# Altium project OpenRex_V1I1.PrjPcb (part 8 of 13)

## Sheet [25] - LEDS, BUTTONS.SchDoc
size A2; DocumentNumber: 25; SheetNumber: 25; SheetTotal: 31
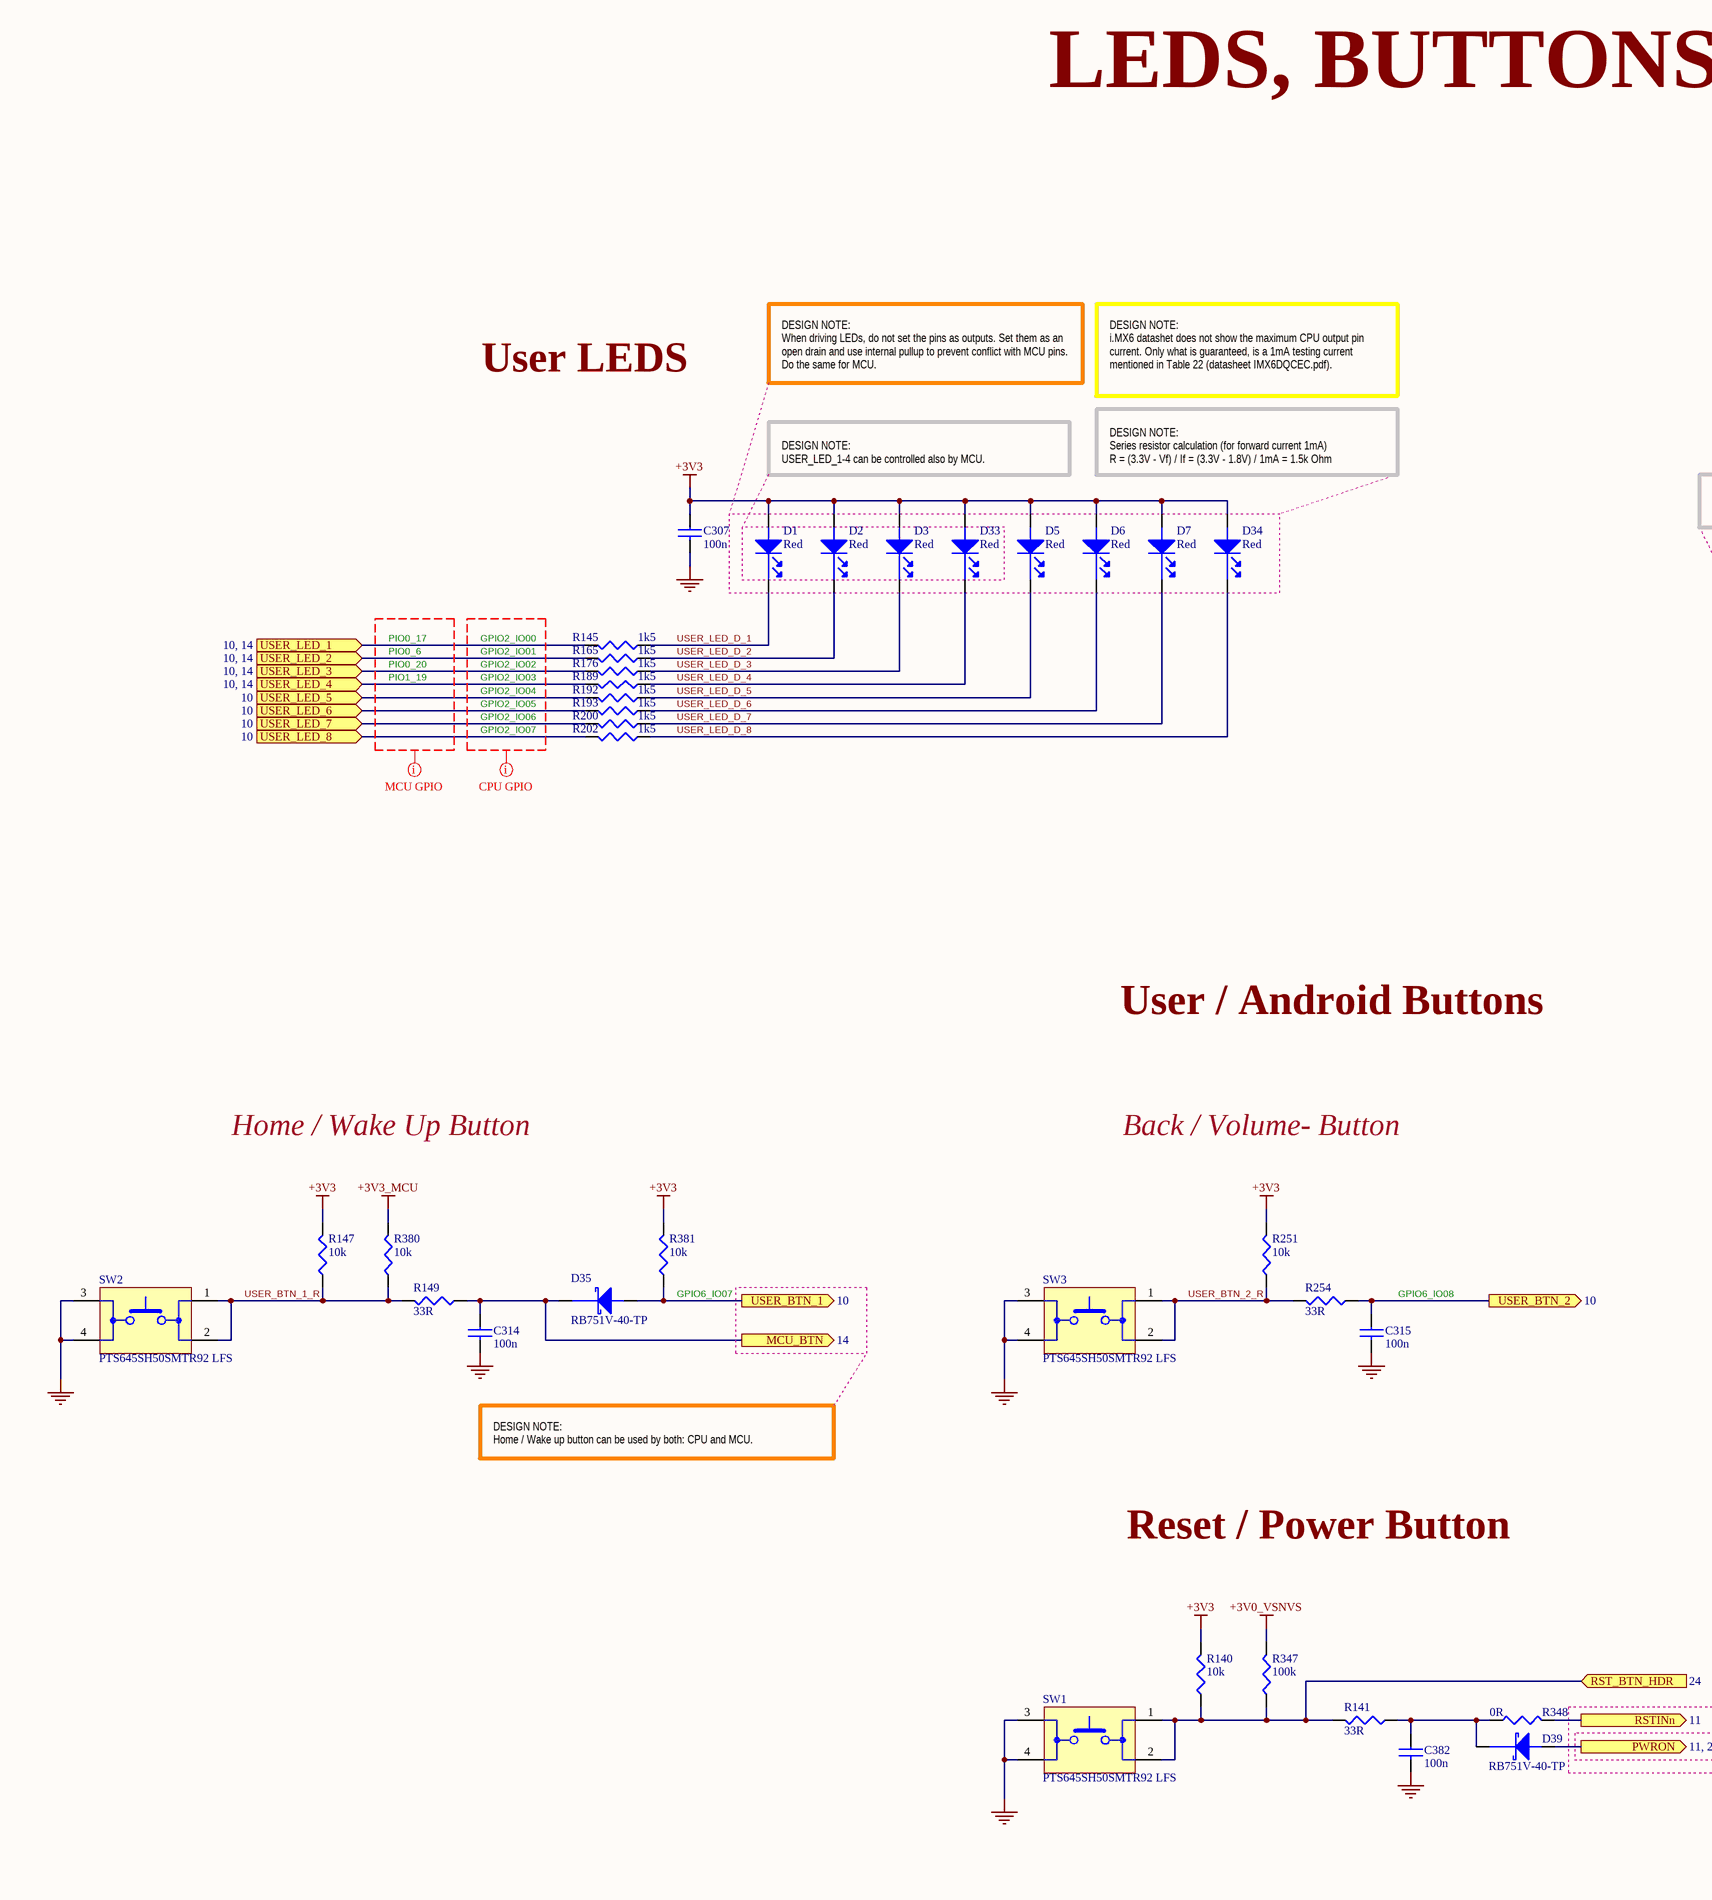
[diagram p32: [25] - LEDS, BUTTONS.SchDoc, left]
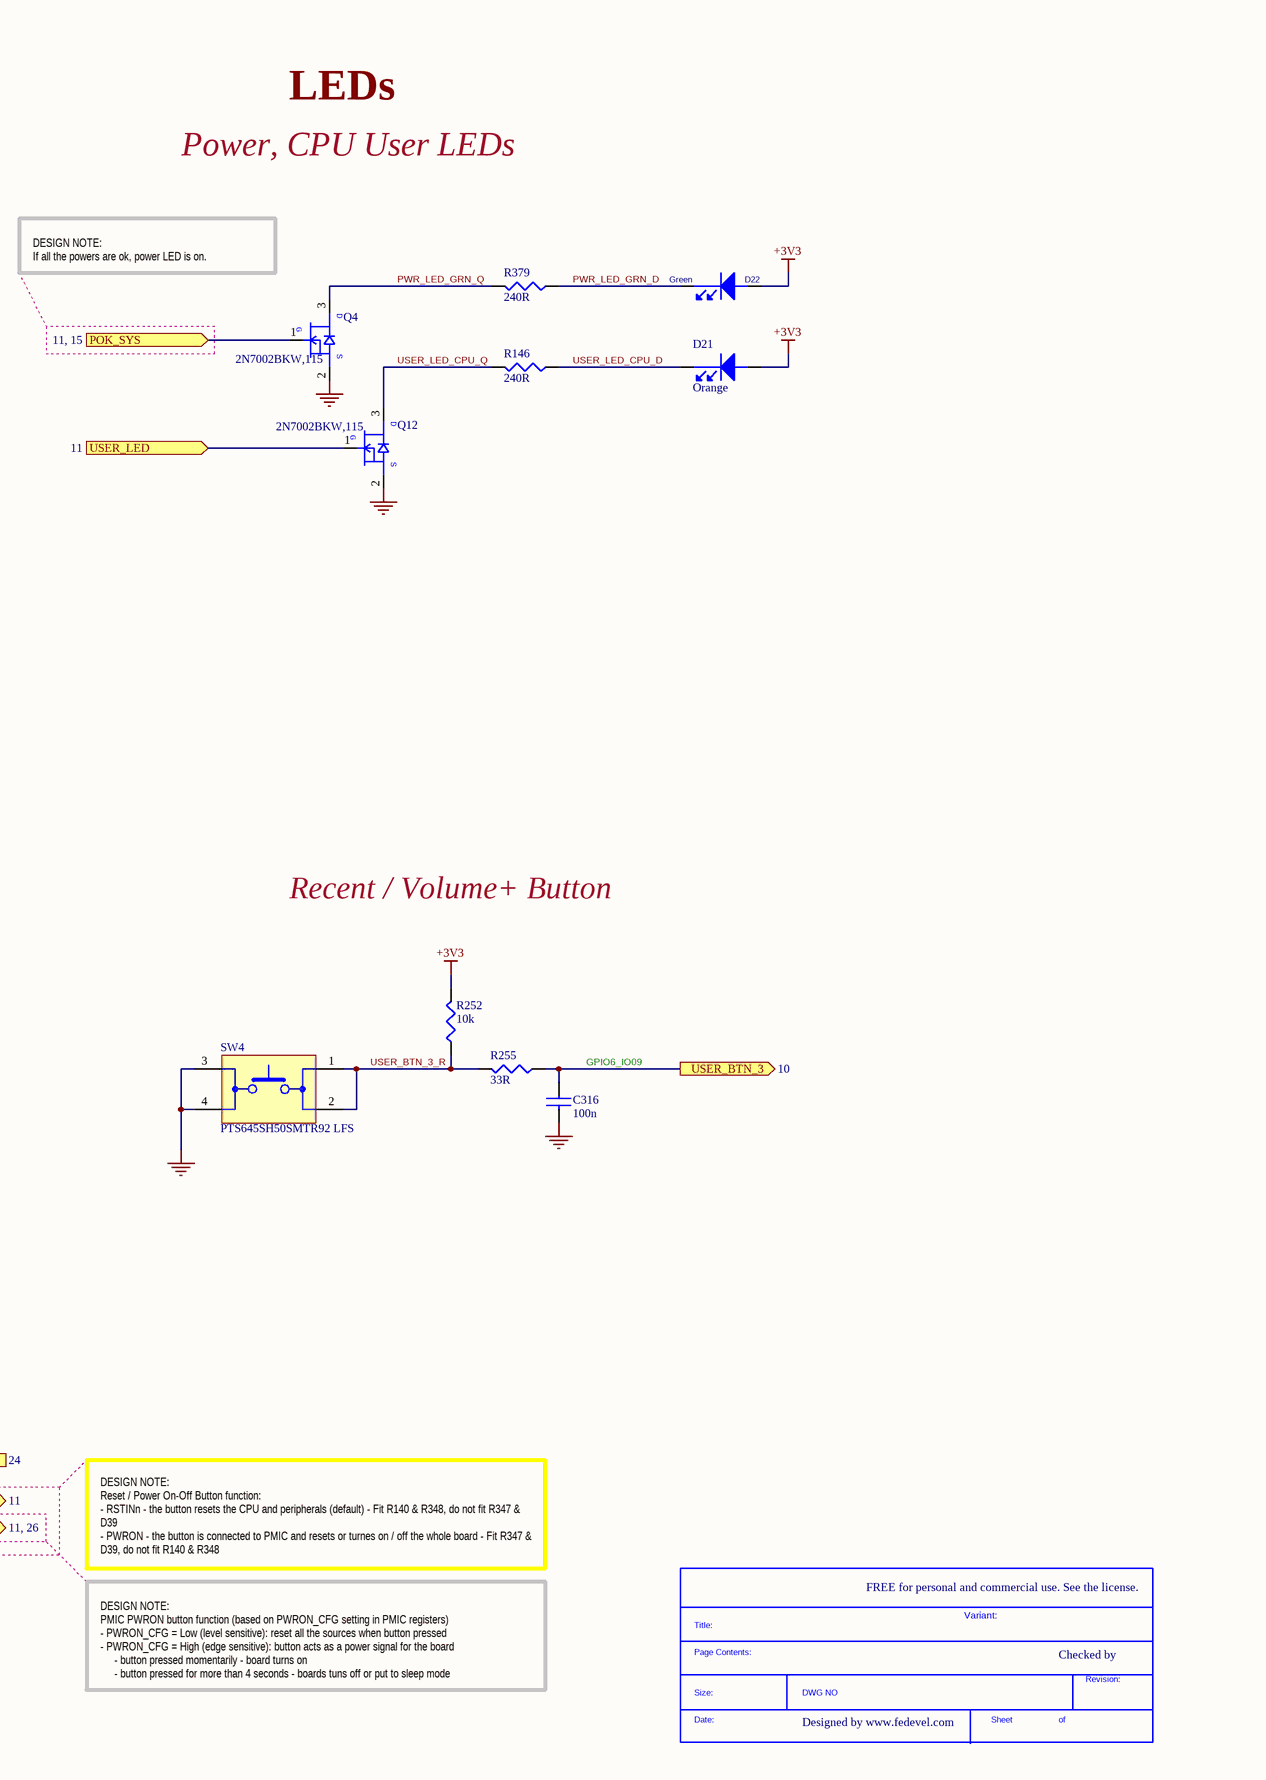
[diagram p33: [25] - LEDS, BUTTONS.SchDoc, right]

### Parts
(Parts that share a designator on the sheet are numbered #1, #2 ... from top to bottom, then left to right.)
*#20  SDTitleBlock  (value not drawn)  (graphical)
C307  100n  [C0402]
C314  100n  [C0402]
C315  100n  [C0402]
C316  100n  [C0402]
C382  100n  [C0402]
D1  Red  [LED_0603]
D2  Red  [LED_0603]
D3  Red  [LED_0603]
D5  Red  [LED_0603]
D6  Red  [LED_0603]
D7  Red  [LED_0603]
D21  Orange  [LED_0603]
D22  Green  [LED_0603]
D33  Red  [LED_0603]
D34  Red  [LED_0603]
D35  RB751V-40-TP  [SOD323]
D39  RB751V-40-TP  [SOD323]
Q4  2N7002BKW,115  [SC70_SOT323]
Q12  2N7002BKW,115  [SC70_SOT323]
R140  10k  [R0402]
R141  33R  [R0402]
R145  1k5  [R0402]
R146  240R  [R0402]
R147  10k  [R0402]
R149  33R  [R0402]
R165  1k5  [R0402]
R176  1k5  [R0402]
R189  1k5  [R0402]
R192  1k5  [R0402]
R193  1k5  [R0402]
R200  1k5  [R0402]
R202  1k5  [R0402]
R251  10k  [R0402]
R252  10k  [R0402]
R254  33R  [R0402]
R255  33R  [R0402]
R347  100k  [R0402]
R348  0R  [R0402]
R379  240R  [R0402]
R380  10k  [R0402]
R381  10k  [R0402]
SW1  PTS645SH50SMTR92 LFS  [TACT_SMD]
SW2  PTS645SH50SMTR92 LFS  [TACT_SMD]
SW3  PTS645SH50SMTR92 LFS  [TACT_SMD]
SW4  PTS645SH50SMTR92 LFS  [TACT_SMD]

### Ports
MCU_BTN (out, see 14), POK_SYS (see 11, 15), PWRON (out, see 11, 26), RST_BTN_HDR (in, see 24), RSTINn (out, see 11), USER_BTN_1 (out, see 10), USER_BTN_2 (out, see 10), USER_BTN_3 (out, see 10), USER_LED (in, see 11), USER_LED_1 (in, see 10, 14), USER_LED_2 (in, see 10, 14), USER_LED_3 (in, see 10, 14), USER_LED_4 (in, see 10, 14), USER_LED_5 (in, see 10), USER_LED_6 (in, see 10), USER_LED_7 (in, see 10), USER_LED_8 (in, see 10)

### Nets
+3V0_VSNVS: R347.2
+3V3: C307.1 D1.2(ANODE) D2.2(ANODE) D3.2(ANODE) D5.2(ANODE) D6.2(ANODE) D7.2(ANODE) D21.2(ANODE) D22.2(ANODE) D33.2(ANODE) D34.2(ANODE) R140.2 R147.2 R251.2 R252.2 R381.2
+3V3_MCU: R380.2
GND: C307.2 C314.2 C315.2 C316.2 C382.2 Q4.2(SOURCE) Q12.2(SOURCE) SW1.3(MECH1) SW1.4(MECH2) SW2.3(MECH1) SW2.4(MECH2) SW3.3(MECH1) SW3.4(MECH2) SW4.3(MECH1) SW4.4(MECH2)
MCU_BTN: C314.1 D35.1(cathode) R149.1 ; port MCU_BTN
POK_SYS: Q4.1(GATE) ; port POK_SYS
PWR_LED_GRN_D: D22.1(cathode) R379.1
PWR_LED_GRN_Q: Q4.3(DRAIN) R379.2
PWRON: D39.2(ANODE) ; port PWRON
RST_BTN_HDR: R140.1 R141.2 R347.1 SW1.1 SW1.2 ; port RST_BTN_HDR
RSTINn: R348.2 ; port RSTINn
USER_BTN_1: D35.2(ANODE) R381.1 ; port USER_BTN_1
USER_BTN_1_R: R147.1 R149.2 R380.1 SW2.1 SW2.2
USER_BTN_2: C315.1 R254.1 ; port USER_BTN_2
USER_BTN_2_R: R251.1 R254.2 SW3.1 SW3.2
USER_BTN_3: C316.1 R255.1 ; port USER_BTN_3
USER_BTN_3_R: R252.1 R255.2 SW4.1 SW4.2
USER_LED: Q12.1(GATE) ; port USER_LED
USER_LED_1: R145.2 ; port USER_LED_1
USER_LED_2: R165.2 ; port USER_LED_2
USER_LED_3: R176.2 ; port USER_LED_3
USER_LED_4: R189.2 ; port USER_LED_4
USER_LED_5: R192.2 ; port USER_LED_5
USER_LED_6: R193.2 ; port USER_LED_6
USER_LED_7: R200.2 ; port USER_LED_7
USER_LED_8: R202.2 ; port USER_LED_8
USER_LED_CPU_D: D21.1(cathode) R146.1
USER_LED_CPU_Q: Q12.3(DRAIN) R146.2
USER_LED_D_1: D1.1(cathode) R145.1
USER_LED_D_2: D2.1(cathode) R165.1
USER_LED_D_3: D3.1(cathode) R176.1
USER_LED_D_4: D33.1(cathode) R189.1
USER_LED_D_5: D5.1(cathode) R192.1
USER_LED_D_6: D6.1(cathode) R193.1
USER_LED_D_7: D7.1(cathode) R200.1
USER_LED_D_8: D34.1(cathode) R202.1
NetC382_1: C382.1 D39.1(cathode) R141.1 R348.1

### Layout directives
mark named CPU GPIO: (no net found under the mark)
mark named MCU GPIO: (no net found under the mark)

### Notes on the sheet
- LEDS, BUTTONS
- User LEDS
- DESIGN NOTE:
  When driving LEDs, do not set the pins as outputs. Set them as an open drain and use internal pullup to prevent conflict with MCU pins. Do the same for MCU.
- DESIGN NOTE:
  i.MX6 datashet does not show the maximum CPU output pin current. Only what is guaranteed, is a 1mA testing current mentioned in Table 22 (datasheet IMX6DQCEC.pdf).
- LEDs
- Power, CPU User LEDs
- DESIGN NOTE:
  USER_LED_1-4 can be controlled also by MCU.
- DESIGN NOTE:
  Series resistor calculation (for forward current 1mA)
  R = (3.3V - Vf) / If = (3.3V - 1.8V) / 1mA = 1.5k Ohm
- DESIGN NOTE:
  If all the powers are ok, power LED is on.
- PIO0_17
- GPIO2_IO00
- PIO1_19
- PIO0_6
- PIO0_20
- GPIO2_IO01
- GPIO2_IO02
- GPIO2_IO03
- GPIO2_IO04
- GPIO2_IO05
- GPIO2_IO06
- GPIO2_IO07
- User / Android Buttons
- Home / Wake Up Button
- Back / Volume- Button
- Recent / Volume+ Button
- (near R381) GPIO6_IO07
- GPIO6_IO08
- GPIO6_IO09
- DESIGN NOTE:
  Home / Wake up button can be used by both: CPU and MCU.
- Reset / Power Button
- DESIGN NOTE:
  Reset / Power On-Off Button function:
  - RSTINn - the button resets the CPU and peripherals (default) - Fit R140 & R348, do not fit R347 & D39
  - PWRON - the button is connected to PMIC and resets or turnes on / off the whole board - Fit R347 & D39, do not fit R140 & R348
- FREE for personal and commercial use. See the license.
- Variant:
- Checked by
- DESIGN NOTE:
  PMIC PWRON button function (based on PWRON_CFG setting in PMIC registers)
  - PWRON_CFG = Low (level sensitive): reset all the sources when button pressed
  - PWRON_CFG = High (edge sensitive): button acts as a power signal for the board
  - button pressed momentarily - board turns on
  - button pressed for more than 4 seconds - boards tuns off or put to sleep mode
- Designed by www.fedevel.com
- (in symbol 2N7002BKW,115) D; G; S
- (in symbol SDTitleBlock) Title:; Page Contents:; Revision:; Size:; DWG NO; Date:; Sheet; of

### Library data of the parts
C307 C314-C316 C382 = C1005X5R1H104K: CAP CER .10UF 50V X5R 10% 0402; Manufacturer: TDK Corporation; Capacitance: 0.1µF; Value: 100nF; .Checked PCB: used; Category: Capacitors; Supplier Part Number: 445-5942-1-ND; Manufacturer Part Number: C1005X5R1H104K; Operating Temperature: -55°C ~ 85°C; Package / Case: 0402 (1005 Metric); Price 1k [$]: 0.02340; .Checked SCH: used; Voltage - Rated: 50V; Supplier: Digikey; Supplier 1: Digi-Key; Supplier Part Number 1: 445-5942-1-ND; RoHS: RoHS Compliant; Stock 1: 106926; Pricing 1: 1=0.27, 10=0.18, 100=0.072, 250=0.05176, 500=0.0369, 1000=0.027 (USD); Tolerance: ±10%; Temperature Coefficient: X5R; Mounting Type: Surface Mount, MLCC; Applications: General Purpose; Ratings: -; Size / Dimension: 0.039" L x 0.020" W (1.00mm x 0.50mm); Height - Seated (Max): -; Thickness (Max): 0.022" (0.55mm); Lead Spacing: -; Features: -; Packaging: Cut Tape (CT); Lead Style: -; ComponentLink1URL: http://www.tdk.co.jp/tefe02/e412_c.pdf; ComponentLink1Description: http://www.tdk.co.jp/tefe02/e412_c.pdf
D1-D3 D5-D7 D33 D34 = LS L29K-H1J2-1-Z: LED SMARTLED RED 630NM 0603 SMD; Manufacturer: OSRAM Opto Semiconductors Inc; Millicandela Rating: 4.95mcd; Voltage - Forward (Vf) Typ: 1.8V; Current - Test: 2mA; Wavelength - Peak: 643nm; Viewing Angle: 160°; Lens Type: Diffused; Lens Style/Size: Rectangle with Flat Top, 1.3mm x 0.8mm; Luminous Flux @ Current - Test: 20 mlm; .Checked PCB: used; Supplier 1: Digi-Key; Supplier Part Number 1: 475-1195-1-ND; Manufacturer Part Number: LS L29K-H1J2-1-Z; RoHS: RoHS Compliant; Category: Optoelectronics; Stock 1: 71670; Pricing 1: 1=0.16, 10=0.137, 100=0.1093, 250=0.09564, 500=0.08744 (USD); Color: Red; Wavelength - Dominant: 630nm; Package / Case: 0603 (1608 Metric); Size / Dimension: 1.70mm L x 0.80mm W; Height: 0.65mm; Mounting Type: Surface Mount; Packaging: Cut Tape (CT); ComponentLink1URL: http://catalog.osram-os.com/catalogue/catalogue.do;jsessionid=DB7CFDBAC5AF1E216E45F622E867085A?act=downloadFile&favOid=020000010003f9de000100b6; ComponentLink1Description: http://catalog.osram-os.com/catalogue/catalogue.do;jsessionid=DB7CFDBAC5AF1E216E45F622E867085A?act=downloadFile&favOid=020000010003f9de000100b6; .Checked SCH: used
D21 = LO L29K-H2K1-24-Z: LED SMARTLED ORANGE 606NM 0603; Manufacturer: OSRAM Opto Semiconductors Inc; Millicandela Rating: 6.3mcd; Voltage - Forward (Vf) Typ: 1.8V; Current - Test: 2mA; Wavelength - Peak: 610nm; Viewing Angle: 160°; Lens Type: Diffused; Lens Style/Size: Rectangle with Flat Top, 1.3mm x 0.8mm; Luminous Flux @ Current - Test: 25 mlm; .Checked PCB: used; Supplier 1: Digi-Key; Supplier Part Number 1: 475-2740-1-ND; Manufacturer Part Number: LO L29K-H2K1-24-Z; RoHS: RoHS Compliant; Category: Optoelectronics; Stock 1: 15900; Pricing 1: 1=0.17, 10=0.141, 100=0.1127, 250=0.0986, 500=0.09016 (USD); Color: Orange; Wavelength - Dominant: 606nm; Package / Case: 0603 (1608 Metric); Size / Dimension: 1.70mm L x 0.80mm W; Height: 0.65mm; Mounting Type: Surface Mount; Packaging: Cut Tape (CT); ComponentLink1URL: http://catalog.osram-os.com/catalogue/catalogue.do;jsessionid=302CF83AF637AE24E40AEB0ADA267EDD?act=downloadFile&favOid=020000010003f9de000100b6; ComponentLink1Description: http://catalog.osram-os.com/catalogue/catalogue.do;jsessionid=302CF83AF637AE24E40AEB0ADA267EDD?act=downloadFile&favOid=020000010003f9de000100b6; .Checked SCH: used
D22 = LG L29K-G2J1-24-Z: LED SMARTLED GREEN 570NM 0603; Manufacturer: OSRAM Opto Semiconductors Inc; .Checked PCB: used; Current - Test: 2mA; Voltage - Forward (Vf) Typ: 1.7V; Luminous Flux @ Current - Test: 12 mlm; Millicandela Rating: 3.92mcd; Wavelength - Peak: 572nm; Lens Type: Diffused; Lens Style/Size: Rectangle with Flat Top, 1.3mm x 0.8mm; Viewing Angle: 160°; Regulator Topology: Positive Fixed; Voltage - Output: 2.5V; Voltage - Input: 2.6 V ~ 6 V; Voltage - Dropout (Typical): 0.16V @ 500mA; Number of Regulators: 1; Current - Output: 500mA; Current - Limit (Min): 600mA; .Checked SCH: used; Category: Optoelectronics; Family: LEDs - <75mA, Discre; Manufacturer Part Number: LG L29K-G2J1-24-Z; Price 1k [$]: 0.08744; Value: Green; Color: Green; Package / Case: 0603 (1608 Metric); Supplier Part Number: 475-2709-1-ND; Supplier: Digikey; Supplier 1: Digi-Key; Supplier Part Number 1: 475-2709-1-ND; RoHS: RoHS Compliant; Stock 1: 30318; Pricing 1: 1=0.16, 10=0.137, 100=0.1093, 250=0.09564, 500=0.08744 (USD); Wavelength - Dominant: 570nm; Size / Dimension: 1.70mm L x 0.80mm W; Height: 0.65mm; Mounting Type: Surface Mount; Packaging: Cut Tape (CT); ComponentLink1URL: http://catalog.osram-os.com/catalogue/catalogue.do;jsessionid=32CB61882C089EDD4B6D0A54E7E1F117?act=downloadFile&favOid=020000020000138e000100b6; ComponentLink1Description: http://catalog.osram-os.com/catalogue/catalogue.do;jsessionid=32CB61882C089EDD4B6D0A54E7E1F117?act=downloadFile&favOid=020000020000138e000100b6; Operating Temperature: -40°C ~ 125°C; Supplier Device Package: 6-TMLF® (1.6x1.6); ComponentLink2URL: http://www.micrel.com/_PDF/mic5353.pdf; ComponentLink2Description: http://www.micrel.com/_PDF/mic5353.pdf
D35 D39 = RB751V-40-TP: DIODE SCHTKY 30MA 30V SOD-323; Manufacturer: Micro Commercial Co; Diode Type: Schottky; Voltage - Forward (Vf) (Max) @ If: 370mV @ 1mA; Speed: Small Signal =< 200mA (Io), Any Speed; Current - Reverse Leakage @ Vr: 500nA @ 30V; Capacitance @ Vr, F: 2pF @ 1V, 1MHz; .Checked PCB: used; Supplier 1: Digi-Key; Supplier Part Number 1: RB751V-40-TPMSCT-ND; Manufacturer Part Number: RB751V-40-TP; RoHS: RoHS Compliant; Category: Discrete Semiconductor Products; Stock 1: 18964; Pricing 1: 1=0.48, 10=0.342, 100=0.2014, 250=0.14252, 500=0.1216, 1000=0.095 (USD); Voltage - DC Reverse (Vr) (Max): 30V; Current - Average Rectified (Io): 30mA; Reverse Recovery Time (trr): -; Mounting Type: Surface Mount; Package / Case: SC-76, SOD-323; Supplier Device Package: SOD-323; Packaging: Cut Tape (CT); ComponentLink1URL: http://61.222.192.61/mccsemi/up_pdf/RB751V-40(SOD-323).PDF; ComponentLink1Description: http://61.222.192.61/mccsemi/up_pdf/RB751V-40(SOD-323).PDF; .Checked SCH: used
Q4 Q12 = 2N7002BKW,115: MOSFET N-CH 60V 310MA SOT323; Manufacturer: NXP Semiconductors; FET Type: MOSFET N-Channel, Metal Oxide; FET Feature: Logic Level Gate; Rds On (Max) @ Id, Vgs: 1.6 Ohm @ 500mA, 10V; Vgs(th) (Max) @ Id: 2.1V @ 250µA; Gate Charge (Qg) @ Vgs: 0.6nC @ 4.5V; Input Capacitance (Ciss) @ Vds: 50pF @ 10V; Power - Max: 275mW; .Checked PCB: used; Supplier 1: Digi-Key; Supplier Part Number 1: 568-5980-1-ND; Manufacturer Part Number: 2N7002BKW,115; RoHS: RoHS Compliant; Category: Discrete Semiconductor Products; Stock 1: 15666; Pricing 1: 1=0.39, 10=0.354, 25=0.2548, 100=0.1983, 250=0.12456, 500=0.10616, 1000=0.07233 (USD); Drain to Source Voltage (Vdss): 60V; Current - Continuous Drain (Id) @ 25° C: 310mA; Mounting Type: Surface Mount; Package / Case: SC-70, SOT-323; Supplier Device Package: SC-70; Packaging: Cut Tape (CT); ComponentLink1URL: http://www.nxp.com/documents/data_sheet/2N7002BKW.pdf; ComponentLink1Description: http://www.nxp.com/documents/data_sheet/2N7002BKW.pdf; .Checked SCH: used
R140 R147 R251 R252 R380 R381 = RC0402FR-0710KL: RES 10.0K OHM 1/16W 1% 0402 SMD; Manufacturer: Yageo; Power (Watts): 0.063W, 1/16W; .Checked PCB: used; Temperature Coefficient: ±100ppm/°C; Category: Resistors; Supplier Part Number: 311-10.0KLRCT-ND; Manufacturer Part Number: RC0402FR-0710KL; Package / Case: 0402 (1005 Metric); Price 1k [$]: 0.01421; Resistance (Ohms): 10K; Tolerance: ±1%; Value: 10k; .Checked SCH: used; Supplier: Digikey; Supplier 1: Digi-Key; Supplier Part Number 1: 311-10.0KLRCT-ND; RoHS: RoHS Compliant; Stock 1: 2916495; Pricing 1: 10=0.014, 50=0.0104, 100=0.0079, 250=0.00584, 500=0.00432, 1000=0.00288 (USD); Composition: Thick Film; Features: -; Size / Dimension: 0.039" L x 0.020" W (1.00mm x 0.50mm); Height: 0.016" (0.40mm); Number of Terminations: 2; Packaging: Cut Tape (CT); ComponentLink1URL: http://www.yageo.com/documents/recent/PYu-RC0402_51_RoHS_L_6.pdf; ComponentLink1Description: http://www.yageo.com/documents/recent/PYu-RC0402_51_RoHS_L_6.pdf
R141 R149 R254 R255 = RMCF0402FT33R0: RES TF 33 OHM 1% 1/16W 0402; Manufacturer: Stackpole Electronics Inc; Resistance (Ohms): 33; Power (Watts): 0.063W, 1/16W; .Checked PCB: used; Temperature Coefficient: ±100ppm/°C; Category: Resistors; Supplier Part Number: RMCF0402FT33R0CT-ND; Manufacturer Part Number: RMCF0402FT33R0; Package / Case: 0402 (1005 Metric); Price 1k [$]: 0.00384; Tolerance: ±1%; Value: 33R; .Checked SCH: used; Supplier: Digikey; Supplier 1: Digi-Key; Supplier Part Number 1: RMCF0402FT33R0CT-ND; RoHS: RoHS Compliant; Stock 1: 26866; Pricing 1: 1=0.04, 10=0.025, 50=0.0138, 100=0.0105, 250=0.0078, 500=0.00576, 1000=0.00384 (USD); Composition: Thick Film; Features: -; Size / Dimension: 0.039" L x 0.020" W (1.00mm x 0.50mm); Height: 0.016" (0.40mm); Number of Terminations: 2; Packaging: Cut Tape (CT); ComponentLink1URL: http://www.seielect.com/Catalog/SEI-RMCF.pdf; ComponentLink1Description: http://www.seielect.com/Catalog/SEI-RMCF.pdf
R145 R165 R176 R189 R192 R193 R200 R202 = RC0402FR-071K5L: RES 1.50K OHM 1/16W 1% 0402 SMD; Manufacturer: Yageo; Resistance (Ohms): 1.5k; Power (Watts): 0.063W, 1/16W; Temperature Coefficient: ±100ppm/°C; .Creator: MM; Supplier 1: Digi-Key; Manufacturer Part Number: RC0402FR-071K5L; RoHS: RoHS Compliant; Category: Resistors; Stock 1: 499348; Pricing 1: 1=0.1, 10=0.014, 25=0.0104, 100=0.0063, 250=0.0054, 500=0.00382, 1000=0.0027, 2500=0.00234, 5000=0.00203 (USD); Packaging: Cut Tape (CT); Tolerance: ±1%; Composition: Thick Film; Features: -; Package / Case: 0402 (1005 Metric); Supplier Device Package: 0402; Size / Dimension: 0.039" L x 0.020" W (1.00mm x 0.50mm); Height: 0.016" (0.40mm); Number of Terminations: 2; ComponentLink1URL: http://www.yageo.com/documents/recent/PYu-RC0402_51_RoHS_L_6.pdf; ComponentLink1Description: http://www.yageo.com/documents/recent/PYu-RC0402_51_RoHS_L_6.pdf; Supplier Part Number 1: 311-1.50KLRCT-ND; .Checked PCB: MM; .Checked SCH: MM
R146 R379 = RMCF0402FT240R: RES TF 240 OHM 1% 0.0625W 0402; Manufacturer: Stackpole Electronics Inc; Resistance (Ohms): 240; Power (Watts): 0.063W, 1/16W; .Checked PCB: used; Temperature Coefficient: ±100ppm/°C; Category: Resistors; Supplier Part Number: RMCF0402FT240RCT-ND; Manufacturer Part Number: RMCF0402FT240R; Package / Case: 0402 (1005 Metric); Price 1k [$]: 0.00384; Tolerance: ±1%; Value: 240R; .Checked SCH: used; Supplier: Digikey; Supplier 1: Digi-Key; Supplier Part Number 1: RMCF0402FT240RCT-ND; RoHS: RoHS Compliant; Stock 1: 39860; Pricing 1: 1=0.04, 10=0.025, 50=0.0138, 100=0.0105, 250=0.0078, 500=0.00576, 1000=0.00384 (USD); Composition: Thick Film; Features: -; Size / Dimension: 0.039" L x 0.020" W (1.00mm x 0.50mm); Height: 0.016" (0.40mm); Number of Terminations: 2; Packaging: Cut Tape (CT); ComponentLink1URL: http://www.seielect.com/Catalog/SEI-RMCF.pdf; ComponentLink1Description: http://www.seielect.com/Catalog/SEI-RMCF.pdf
R347 = RMCF0402FT100K: RES 100K OHM 1/16W 1% 0402 SMD; Manufacturer: Stackpole Electronics Inc; Power (Watts): 0.063W, 1/16W; .Checked PCB: used; Temperature Coefficient: ±100ppm/°C; Category: Resistors; Supplier Part Number: RMCF0402FT100KCT-ND; Manufacturer Part Number: RMCF0402FT100K; Package / Case: 0402 (1005 Metric); Price 1k [$]: 0.00384; Resistance (Ohms): 100K; Tolerance: ±1%; Value: 100k; .Checked SCH: used; Supplier: Digikey; Supplier 1: Digi-Key; Supplier Part Number 1: RMCF0402FT100KCT-ND; RoHS: RoHS Compliant; Stock 1: 95; Pricing 1: 1=0.04, 10=0.025, 50=0.0138, 100=0.0105, 250=0.0078, 500=0.00576, 1000=0.00384 (USD); Composition: Thick Film; Features: -; Size / Dimension: 0.039" L x 0.020" W (1.00mm x 0.50mm); Height: 0.016" (0.40mm); Number of Terminations: 2; Packaging: Cut Tape (CT); ComponentLink1URL: http://www.seielect.com/Catalog/SEI-RMCF.pdf; ComponentLink1Description: http://www.seielect.com/Catalog/SEI-RMCF.pdf
R348 = RC0402JR-070RL: RES 0.0 OHM 1/16W 0402 SMD; Manufacturer: Yageo; Resistance (Ohms): 0.0; Power (Watts): 0.063W, 1/16W; Tolerance: Jumper; .Checked PCB: used; Category: Resistors; Supplier Part Number: 311-0.0JRCT-ND; Manufacturer Part Number: RC0402JR-070RL; Package / Case: 0402 (1005 Metric); Price 1k [$]: 0.01389; Value: 0R; .Checked SCH: used; Supplier: Digikey; Supplier 1: Digi-Key; Supplier Part Number 1: 311-0.0JRCT-ND; RoHS: RoHS Compliant; Stock 1: 1106330; Pricing 1: 10=0.012, 50=0.009, 100=0.0069, 250=0.00512, 500=0.0038, 1000=0.00253 (USD); Composition: Thick Film; Features: -; Temperature Coefficient: -; Size / Dimension: 0.039" L x 0.020" W (1.00mm x 0.50mm); Height: 0.016" (0.40mm); Number of Terminations: 2; Packaging: Cut Tape (CT); ComponentLink1URL: http://www.yageo.com/documents/recent/PYu-RC0402_51_RoHS_L_6.pdf; ComponentLink1Description: http://www.yageo.com/documents/recent/PYu-RC0402_51_RoHS_L_6.pdf
SW1-SW4 = PTS645SH50SMTR92 LFS: SWITCH TACTILE SPST-NO 0.05A 12V; Manufacturer: C&K Components; Switch Function: Off-Mom; Contact Rating @ Voltage: 0.05A @ 12VDC; Actuator Type: Standard; Actuator Height off PCB, from Pins: 5.00mm; Actuator Orientation: Top Actuated; Outline: 6.00mm x 6.00mm; Illumination: Non-Illuminated; Operating Force: 200gf; Actuator Material: Polyamide (PA66), Nylon 6/6; Mechanical Life: 100,000 Cycles; .Checked PCB: MM; Supplier 1: Digi-Key; Manufacturer Part Number: PTS645SH50SMTR92 LFS; RoHS: RoHS Compliant; Category: Switches; Stock 1: 61129; Pricing 1: 1=0.29, 10=0.281, 25=0.2712, 50=0.2614, 100=0.2468, 250=0.23232, 500=0.22264 (USD); Packaging: Cut Tape (CT); Circuit: SPST-NO; Mounting Type: Surface Mount; Termination Style: Gull Wing; Illumination Voltage (Nominal): -; Illumination Type, Color: -; Ingress Protection: -; Features: -; Switch Travel: -; Operating Temperature: -20°C ~ 60°C; ComponentLink1URL: http://www.ck-components.com/14409/pts645_25apr13.pdf/; ComponentLink1Description: http://www.ck-components.com/14409/pts645_25apr13.pdf/; Supplier Part Number 1: CKN9085CT-ND; .Checked SCH: MM; .Creator: MM

## Sheet [26] - PWR PMIC.SchDoc
size A2; DocumentNumber: 26; SheetNumber: 26; SheetTotal: 31
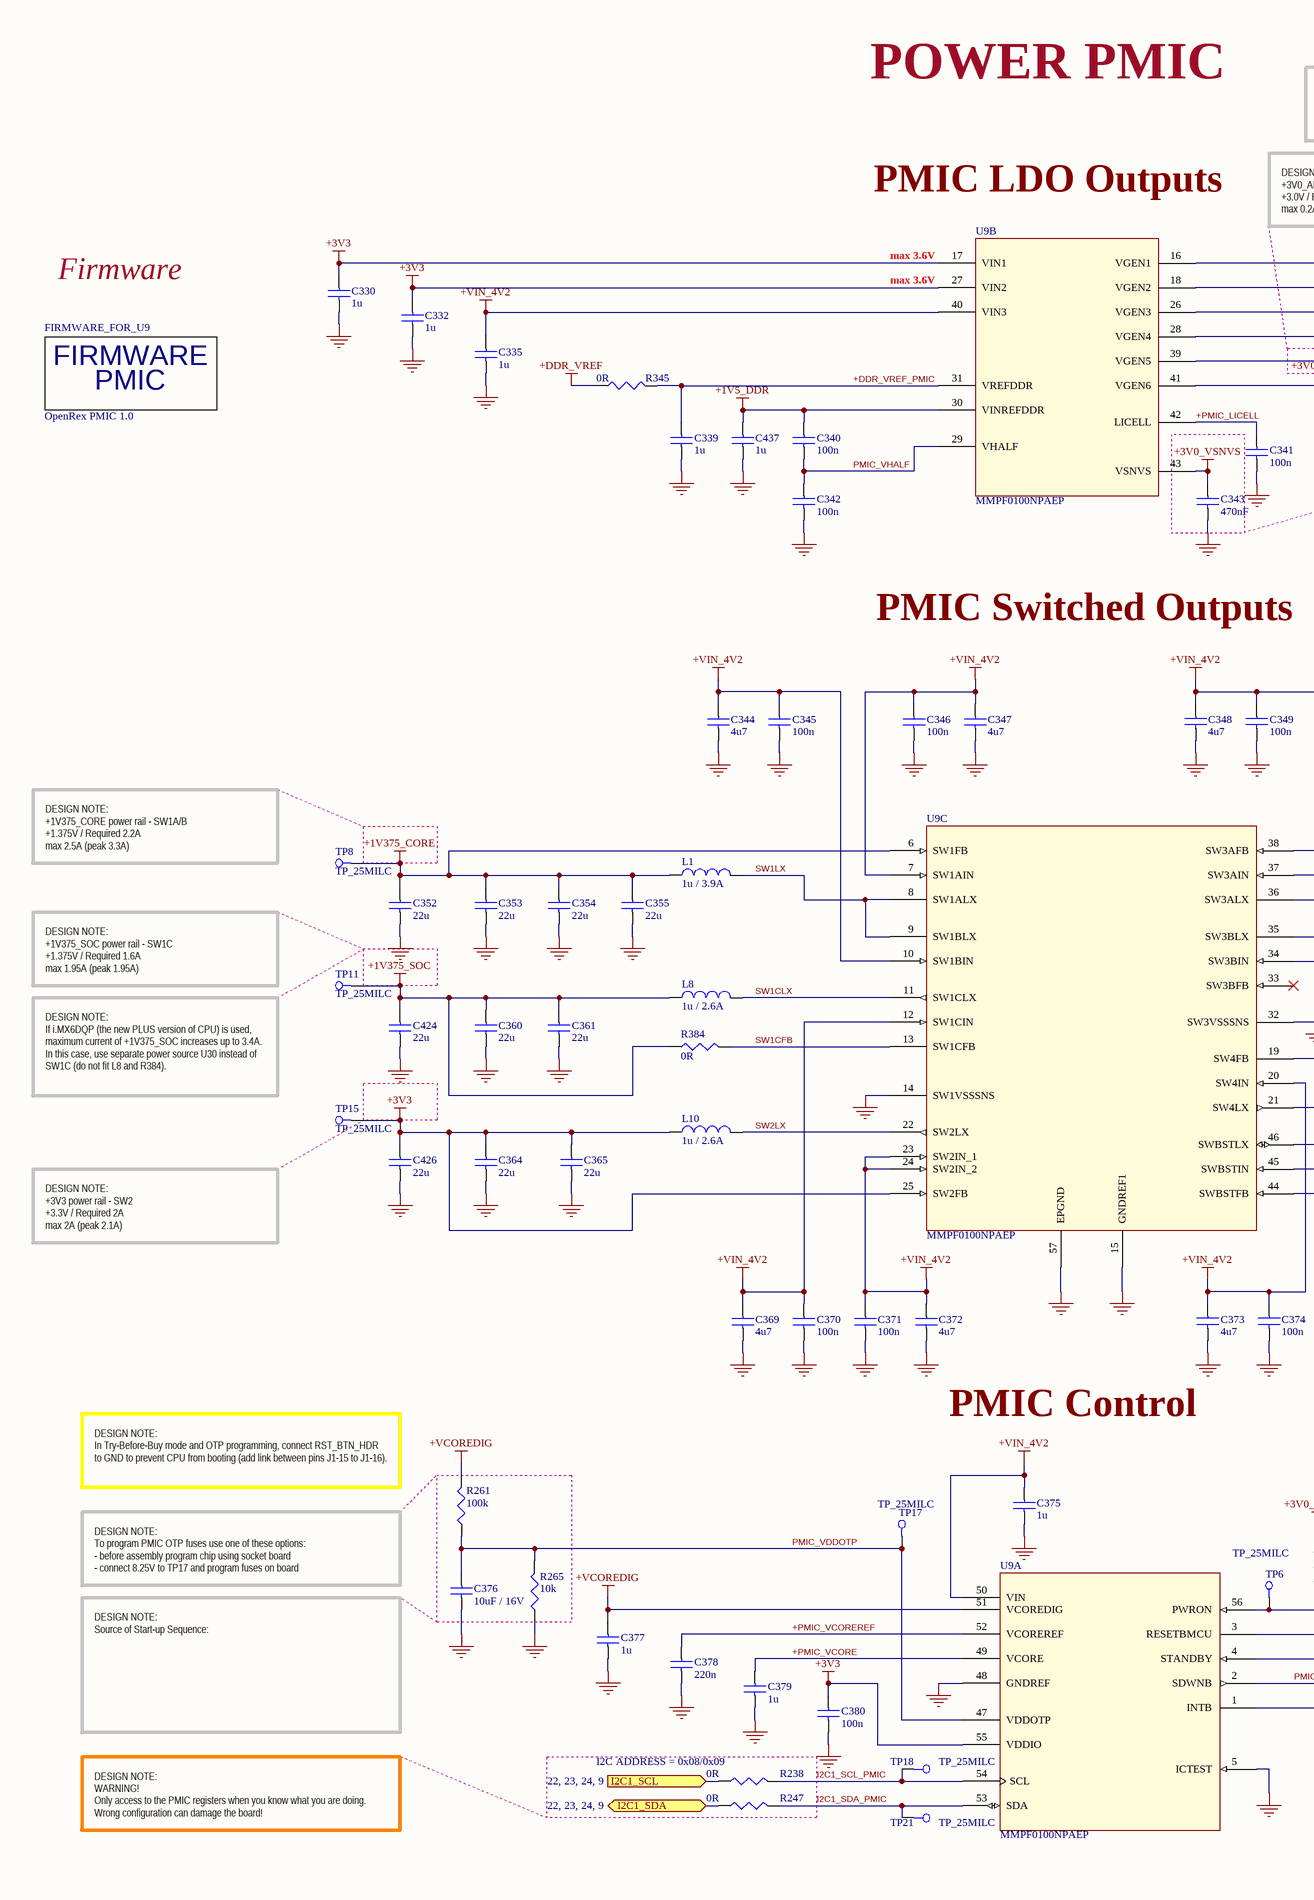
[diagram p34: [26] - PWR PMIC.SchDoc, left]
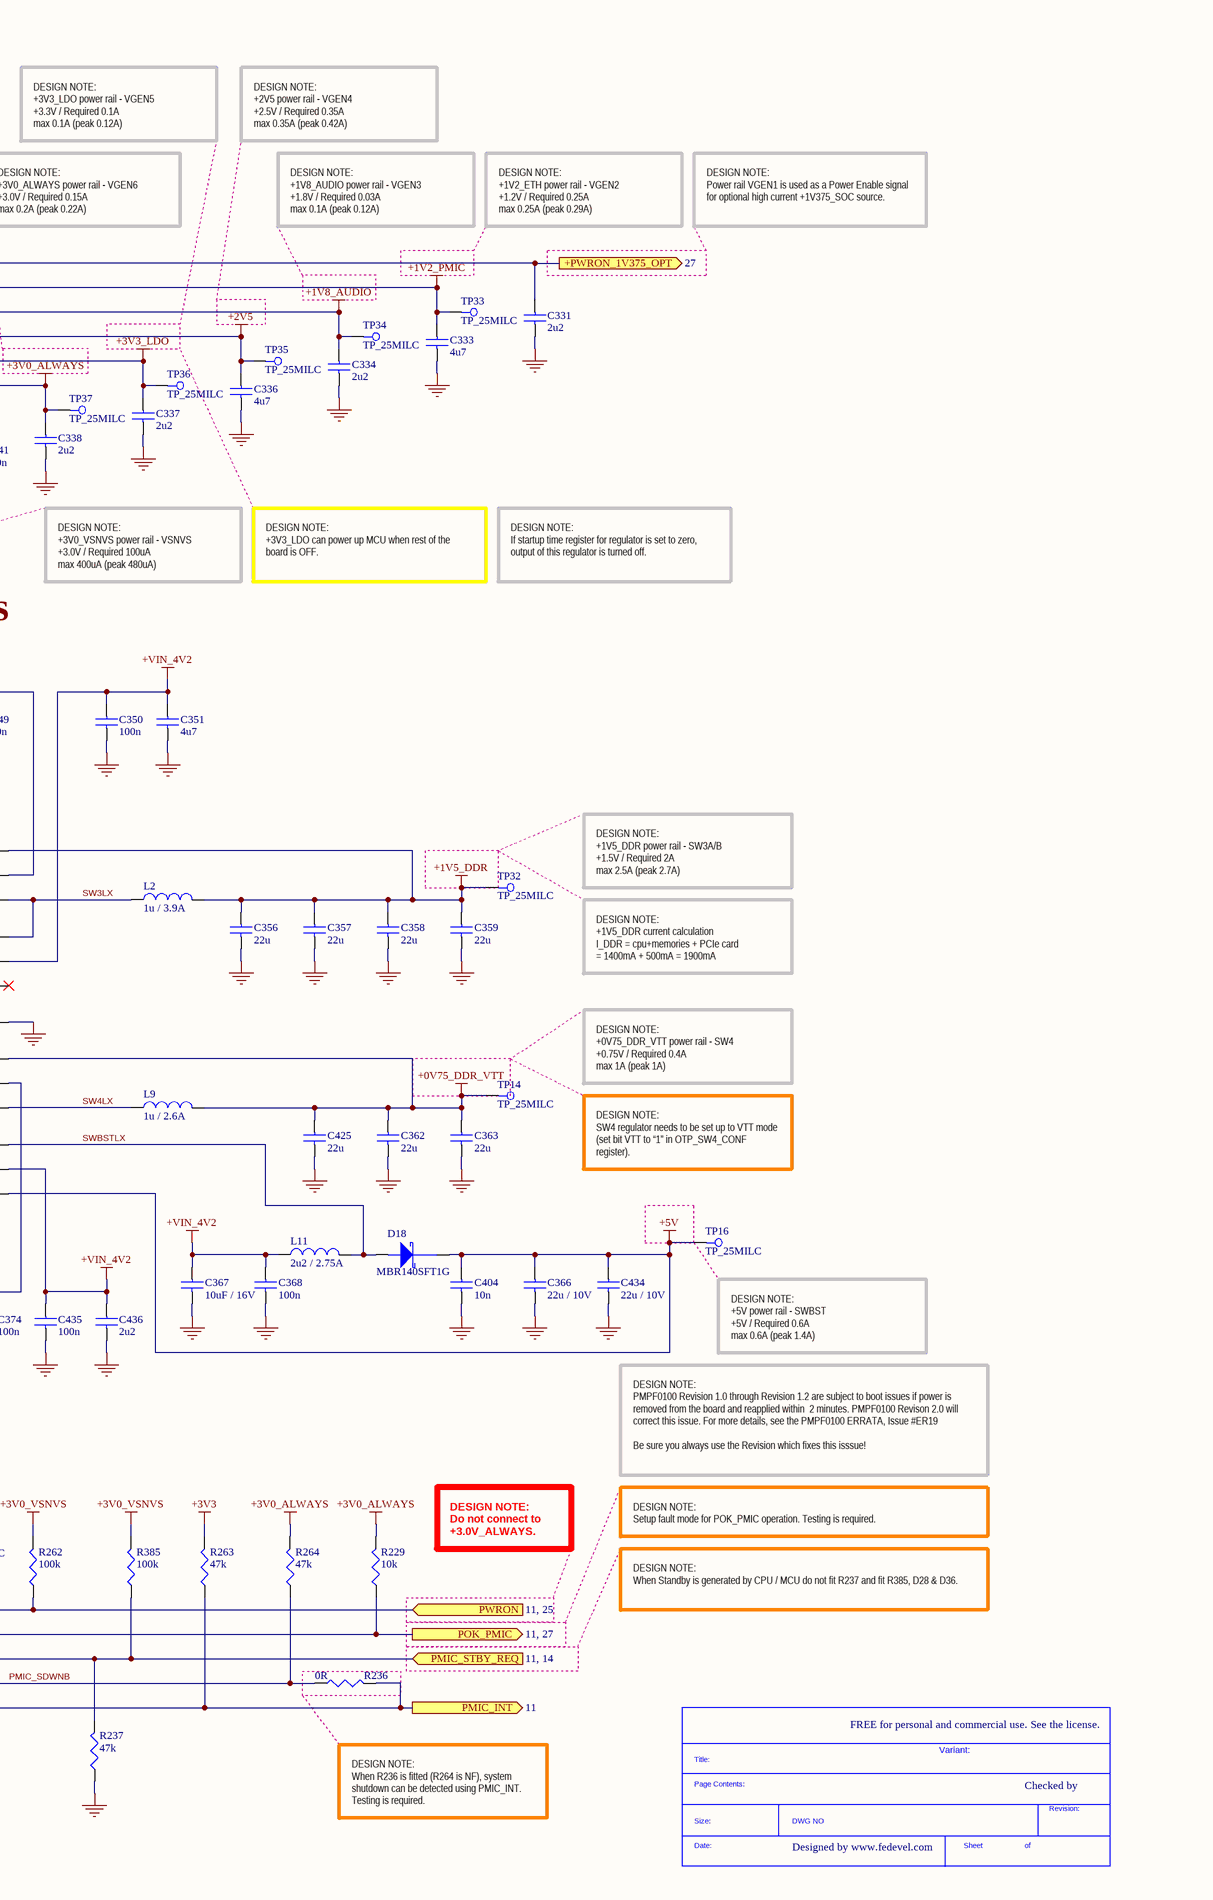
[diagram p35: [26] - PWR PMIC.SchDoc, right]

### Parts
(Parts that share a designator on the sheet are numbered #1, #2 ... from top to bottom, then left to right.)
*#21  SDTitleBlock  (value not drawn)  (graphical)
C330  1u  [C0402]
C331  2u2  [C0402]
C332  1u  [C0402]
C333  4u7  [C0402]
C334  2u2  [C0402]
C335  1u  [C0402]
C336  4u7  [C0402]
C337  2u2  [C0402]
C338  2u2  [C0402]
C339  1u  [C0402]
C340  100n  [C0402]
C341  100n  [C0402]
C342  100n  [C0402]
C343  470nF  [C0402]
C344  4u7  [C0402]
C345  100n  [C0402]
C346  100n  [C0402]
C347  4u7  [C0402]
C348  4u7  [C0402]
C349  100n  [C0402]
C350  100n  [C0402]
C351  4u7  [C0402]
C352  22u  [C0603]
C353  22u  [C0603]
C354  22u  [C0603]
C355  22u  [C0603]
C356  22u  [C0603]
C357  22u  [C0603]
C358  22u  [C0603]
C359  22u  [C0603]
C360  22u  [C0603]
C361  22u  [C0603]
C362  22u  [C0603]
C363  22u  [C0603]
C364  22u  [C0603]
C365  22u  [C0603]
C366  22u / 10V  [C0603]
C367  10uF / 16V  [C0805]
C368  100n  [C0402]
C369  4u7  [C0402]
C370  100n  [C0402]
C371  100n  [C0402]
C372  4u7  [C0402]
C373  4u7  [C0402]
C374  100n  [C0402]
C375  1u  [C0402]
C376  10uF / 16V  [C0805]
C377  1u  [C0402]
C378  220n  [C0402]
C379  1u  [C0402]
C380  100n  [C0402]
C404  10n  [C0402]
C424  22u  [C0603]
C425  22u  [C0603]
C426  22u  [C0603]
C434  22u / 10V  [C0603]
C435  100n  [C0402]
C436  2u2  [C0402]
C437  1u  [C0402]
D18  MBR140SFT1G  [SOD-123FL]
FIRMWARE_FOR_U9  OpenRex PMIC 1.0  (mechanical)
L1  1u / 3.9A  [IHLP_118MILX144MIL]
L2  1u / 3.9A  [IHLP_118MILX144MIL]
L8  1u / 2.6A  [IFSC_79MILX98MIL]
L9  1u / 2.6A  [IFSC_79MILX98MIL]
L10  1u / 2.6A  [IFSC_79MILX98MIL]
L11  2u2 / 2.75A  [IHLP_160MILX175MIL]
R229  10k  [R0402]
R236  0R  [R0402]
R237  47k  [R0402]
R238  0R  [R0402]
R247  0R  [R0402]
R261  100k  [R0402]
R262  100k  [R0402]
R263  47k  [R0402]
R264  47k  [R0402]
R265  10k  [R0402]
R345  0R  [R0402]
R384  0R  [R0402]
R385  100k  [R0402]
TP6  TP_25MILC  [TP_25C]  (no BOM)
TP8  TP_25MILC  [TP_25C]  (no BOM)
TP11  TP_25MILC  [TP_25C]  (no BOM)
TP14  TP_25MILC  [TP_25C]  (no BOM)
TP15  TP_25MILC  [TP_25C]  (no BOM)
TP16  TP_25MILC  [TP_25C]  (no BOM)
TP17  TP_25MILC  [TP_25C]  (no BOM)
TP18  TP_25MILC  [TP_25C]  (no BOM)
TP21  TP_25MILC  [TP_25C]  (no BOM)
TP32  TP_25MILC  [TP_25C]  (no BOM)
TP33  TP_25MILC  [TP_25C]  (no BOM)
TP34  TP_25MILC  [TP_25C]  (no BOM)
TP35  TP_25MILC  [TP_25C]  (no BOM)
TP36  TP_25MILC  [TP_25C]  (no BOM)
TP37  TP_25MILC  [TP_25C]  (no BOM)
U9  MMPF0100NPAEP  [56-VFQFN EP]  (parts A,B,C of 3)

### Blocks framed on the sheet
I2C ADDRESS = 0x08/0x09: R238 R247

### Ports
+PWRON_1V375_OPT (see 27), I2C1_SCL (see 22, 23, 24, 9), I2C1_SDA (bidir, see 22, 23, 24, 9), PMIC_INT (out, see 11), PMIC_STBY_REQ (in, see 11, 14), POK_PMIC (see 11, 27), PWRON (in, see 11, 25)

### Nets
+0V75_DDR_VTT: C362.1 C363.1 C425.1 L9.2 TP14.1 U9.19(SW4FB)
+1V2_PMIC: C333.1 TP33.1 U9.18(VGEN2)
+1V5_DDR: C340.1 C356.1 C357.1 C358.1 C359.1 C437.1 L2.2 TP32.1 U9.30(VINREFDDR) U9.38(SW3AFB)
+1V8_AUDIO: C334.1 TP34.1 U9.26(VGEN3)
+1V375_CORE: C352.1 C353.1 C354.1 C355.1 L1.2 TP8.1 U9.6(SW1FB)
+1V375_SOC: C360.1 C361.1 C424.1 L8.1 R384.1 TP11.1
+2V5: C336.1 TP35.1 U9.28(VGEN4)
+3V0_ALWAYS: C338.1 R229.2 R264.2 TP37.1 U9.41(VGEN6)
+3V0_VSNVS: C343.1 R262.2 R385.2 U9.43(VSNVS)
+3V3: C330.1 C332.1 C364.1 C365.1 C380.1 C426.1 L10.2 R263.2 TP15.1 U9.17(VIN1) U9.25(SW2FB) U9.27(VIN2) U9.55(VDDIO)
+3V3_LDO: C337.1 TP36.1 U9.39(VGEN5)
+5V: C366.1 C404.1 C434.1 D18.1(Cathode) TP16.1 U9.44(SWBSTFB)
+DDR_VREF: R345.1
+VCOREDIG: C377.1 R261.2 U9.51(VCOREDIG)
+VIN_4V2: C335.1 C344.1 C345.1 C346.1 C347.1 C348.1 C349.1 C350.1 C351.1 C367.1 C368.1 C369.1 C370.1 C371.1 C372.1 C373.1 C374.1 C375.1 C435.1 C436.1 L11.1 U9.7(SW1AIN) U9.10(SW1BIN) U9.12(SW1CIN) U9.20(SW4IN) U9.23(SW2IN_1) U9.24(SW2IN_2) U9.34(SW3BIN) U9.37(SW3AIN) U9.40(VIN3) U9.45(SWBSTIN) U9.50(VIN)
GND: C330.2 C331.2 C332.2 C333.2 C334.2 C335.2 C336.2 C337.2 C338.2 C339.2 C341.2 C342.2 C343.2 C344.2 C345.2 C346.2 C347.2 C348.2 C349.2 C350.2 C351.2 C352.2 C353.2 C354.2 C355.2 C356.2 C357.2 C358.2 C359.2 C360.2 C361.2 C362.2 C363.2 C364.2 C365.2 C366.2 C367.2 C368.2 C369.2 C370.2 C371.2 C372.2 C373.2 C374.2 C375.2 C376.2 C377.2 C378.2 C379.2 C380.2 C404.2 C424.2 C425.2 C426.2 C434.2 C435.2 C436.2 C437.2 R237.1 R265.1 U9.5(ICTEST) U9.14(SW1VSSSNS) U9.15(GNDREF1) U9.32(SW3VSSSNS) U9.48(GNDREF) U9.57(EPGND)
+DDR_VREF_PMIC: C339.1 R345.2 U9.31(VREFDDR)
+PMIC_LICELL: C341.1 U9.42(LICELL)
+PMIC_VCORE: C379.1 U9.49(VCORE)
+PMIC_VCOREREF: C378.1 U9.52(VCOREREF)
+PWRON_1V375_OPT: C331.1 U9.16(VGEN1) ; port +PWRON_1V375_OPT
I2C1_SCL: R238.1 ; port I2C1_SCL
I2C1_SCL_PMIC: R238.2 TP18.1 U9.54(SCL)
I2C1_SDA: R247.1 ; port I2C1_SDA
I2C1_SDA_PMIC: R247.2 TP21.1 U9.53(SDA)
PMIC_INT: R236.2 R263.1 U9.1(INTB) ; port PMIC_INT
PMIC_SDWNB: R236.1 R264.1 U9.2(SDWNB)
PMIC_STBY_REQ: R237.2 R385.1 U9.4(STANDBY) ; port PMIC_STBY_REQ
PMIC_VDDOTP: C376.1 R261.1 R265.2 TP17.1 U9.47(VDDOTP)
PMIC_VHALF: C340.2 C342.1 U9.29(VHALF)
POK_PMIC: R229.1 U9.3(RESETBMCU) ; port POK_PMIC
PWRON: R262.1 TP6.1 U9.56(PWRON) ; port PWRON
SW1CFB: R384.2 U9.13(SW1CFB)
SW1CLX: L8.2 U9.11(SW1CLX)
SW1LX: L1.1 U9.8(SW1ALX) U9.9(SW1BLX)
SW2LX: L10.1 U9.22(SW2LX)
SW3LX: L2.1 U9.35(SW3BLX) U9.36(SW3ALX)
SW4LX: L9.1 U9.21(SW4LX)
SWBSTLX: D18.2(Anode) L11.2 U9.46(SWBSTLX)

Not connected (* = marked no-connect by the designer): U9 33(SW3BFB)*

### Notes on the sheet
- POWER PMIC
- DESIGN NOTE:
  +3V3_LDO power rail - VGEN5
  +3.3V / Required 0.1A
  max 0.1A (peak 0.12A)
- DESIGN NOTE:
  +2V5 power rail - VGEN4
  +2.5V / Required 0.35A
  max 0.35A (peak 0.42A)
- PMIC LDO Outputs
- DESIGN NOTE:
  +3V0_ALWAYS power rail - VGEN6
  +3.0V / Required 0.15A
  max 0.2A (peak 0.22A)
- DESIGN NOTE:
  +1V8_AUDIO power rail - VGEN3
  +1.8V / Required 0.03A
  max 0.1A (peak 0.12A)
- DESIGN NOTE:
  +1V2_ETH power rail - VGEN2
  +1.2V / Required 0.25A
  max 0.25A (peak 0.29A)
- (near U9) max 3.6V
- DESIGN NOTE:
  Power rail VGEN1 is used as a Power Enable signal for optional high current +1V375_SOC source.
- Firmware
- DESIGN NOTE:
  +3V0_VSNVS power rail - VSNVS
  +3.0V / Required 100uA
  max 400uA (peak 480uA)
- DESIGN NOTE:
  +3V3_LDO can power up MCU when rest of the board is OFF.
- DESIGN NOTE:
  If startup time register for regulator is set to zero, output of this regulator is turned off.
- PMIC Switched Outputs
- DESIGN NOTE:
  +1V375_CORE power rail - SW1A/B
  +1.375V / Required 2.2A
  max 2.5A (peak 3.3A)
- DESIGN NOTE:
  +1V5_DDR power rail - SW3A/B
  +1.5V / Required 2A
  max 2.5A (peak 2.7A)
- DESIGN NOTE:
  +1V375_SOC power rail - SW1C
  +1.375V / Required 1.6A
  max 1.95A (peak 1.95A)
- DESIGN NOTE:
  +1V5_DDR current calculation
  I_DDR = cpu+memories + PCIe card
  = 1400mA + 500mA = 1900mA
- DESIGN NOTE:
  +0V75_DDR_VTT power rail - SW4
  +0.75V / Required 0.4A
  max 1A (peak 1A)
- DESIGN NOTE:
  If i.MX6DQP (the new PLUS version of CPU) is used, maximum current of +1V375_SOC increases up to 3.4A.
  In this case, use separate power source U30 instead of SW1C (do not fit L8 and R384).
- DESIGN NOTE:
  SW4 regulator needs to be set up to VTT mode (set bit VTT to “1” in OTP_SW4_CONF register).
- DESIGN NOTE:
  +3V3 power rail - SW2
  +3.3V / Required 2A
  max 2A (peak 2.1A)
- DESIGN NOTE:
  +5V power rail - SWBST
  +5V / Required 0.6A
  max 0.6A (peak 1.4A)
- PMIC Control
- DESIGN NOTE:
  In Try-Before-Buy mode and OTP programming, connect RST_BTN_HDR to GND to prevent CPU from booting (add link between pins J1-15 to J1-16).
- DESIGN NOTE:
  PMPF0100 Revision 1.0 through Revision 1.2 are subject to boot issues if power is removed from the board and reapplied within  2 minutes. PMPF0100 Revison 2.0 will correct this issue. For more details, see the PMPF0100 ERRATA, Issue #ER19
  Be sure you always use the Revision which fixes this isssue!
- DESIGN NOTE:
  Do not connect to +3.0V_ALWAYS.
- DESIGN NOTE:
  Setup fault mode for POK_PMIC operation. Testing is required.
- DESIGN NOTE:
  To program PMIC OTP fuses use one of these options:
  - before assembly program chip using socket board
  - connect 8.25V to TP17 and program fuses on board
- DESIGN NOTE:
  When Standby is generated by CPU / MCU do not fit R237 and fit R385, D28 & D36.
- DESIGN NOTE:
  Source of Start-up Sequence:
- FREE for personal and commercial use. See the license.
- Variant:
- Checked by
- DESIGN NOTE:
  WARNING!
  Only access to the PMIC registers when you know what you are doing. Wrong configuration can damage the board!
- DESIGN NOTE:
  When R236 is fitted (R264 is NF), system shutdown can be detected using PMIC_INT. Testing is required.
- Designed by www.fedevel.com
- (in symbol FIRMWARE_OpenRex_PMIC_1.0) FIRMWARE; PMIC
- (in symbol SDTitleBlock) Title:; Page Contents:; Revision:; Size:; DWG NO; Date:; Sheet; of

### Library data of the parts
C330 C332 C335 C339 C375 C377 C379 C437 = C1005X5R1C105K: CAP CER 1.0UF 16V X5R 0402; Manufacturer: TDK Corporation; Capacitance: 1.0µF; Value: 1uF; .Checked PCB: used; Tolerance: ±10%; Category: Capacitors; Supplier Part Number: 445-4978-1-ND; Manufacturer Part Number: C1005X5R1C105K; Operating Temperature: -55°C ~ 85°C; Package / Case: 0402 (1005 Metric); Price 1k [$]: 0.02080; .Checked SCH: used; Voltage - Rated: 16V; Supplier: Digikey; Supplier 1: Digi-Key; Supplier Part Number 1: 445-4978-1-ND; RoHS: RoHS Compliant; Stock 1: 341010; Pricing 1: 1=0.24, 10=0.16, 100=0.064, 250=0.046, 500=0.0328, 1000=0.024 (USD); Temperature Coefficient: X5R; Mounting Type: Surface Mount, MLCC; Applications: General Purpose; Ratings: -; Size / Dimension: 0.039" L x 0.020" W (1.00mm x 0.50mm); Height - Seated (Max): -; Thickness (Max): 0.022" (0.55mm); Lead Spacing: -; Features: -; Packaging: Cut Tape (CT); Lead Style: -; ComponentLink1URL: http://www.tdk.co.jp/tefe02/e412_c.pdf; ComponentLink1Description: http://www.tdk.co.jp/tefe02/e412_c.pdf
C331 C334 C337 C338 C436 = C1005X5R1A225K: CAP CER 2.2UF 10V 10% X5R 0402; Manufacturer: TDK Corporation; Capacitance: 2.2µF; .Checked PCB: used; Supplier 1: Digi-Key; Supplier Part Number 1: 445-7392-1-ND; Manufacturer Part Number: C1005X5R1A225K; RoHS: RoHS Compliant; Category: Capacitors; Stock 1: 22891; Pricing 1: 1=0.42, 10=0.332, 100=0.2, 250=0.15, 500=0.128, 1000=0.1 (USD); Voltage - Rated: 10V; Tolerance: ±10%; Temperature Coefficient: X5R; Mounting Type: Surface Mount, MLCC; Operating Temperature: -55°C ~ 85°C; Applications: General Purpose; Ratings: -; Package / Case: 0402 (1005 Metric); Size / Dimension: 0.039" L x 0.020" W (1.00mm x 0.50mm); Height - Seated (Max): -; Thickness (Max): 0.022" (0.55mm); Lead Spacing: -; Features: -; Packaging: Cut Tape (CT); Lead Style: -; ComponentLink1URL: http://www.tdk.com/pdf/general_B11.pdf; ComponentLink1Description: http://www.tdk.com/pdf/general_B11.pdf; .Checked SCH: used
C333 C336 C344 C347 C348 C351 C369 C372 C373 = C1005X5R1A475M: CAP CER 4.7UF 10V 20% X5R 0402; Manufacturer: TDK Corporation; Capacitance: 4.7µF; .Checked PCB: used; Supplier 1: Digi-Key; Supplier Part Number 1: 445-8023-1-ND; Manufacturer Part Number: C1005X5R1A475M; RoHS: RoHS Compliant; Category: Capacitors; Stock 1: 10140; Pricing 1: 1=0.53, 10=0.415, 100=0.25, 250=0.18752, 500=0.16, 1000=0.125, 5000=0.095 (USD); Voltage - Rated: 10V; Tolerance: ±20%; Temperature Coefficient: X5R; Mounting Type: Surface Mount, MLCC; Operating Temperature: -55°C ~ 85°C; Applications: General Purpose; Ratings: -; Package / Case: 0402 (1005 Metric); Size / Dimension: 0.039" L x 0.020" W (1.00mm x 0.50mm); Height - Seated (Max): -; Thickness (Max): -; Lead Spacing: -; Features: -; Packaging: Cut Tape (CT); Lead Style: -; ComponentLink1URL: http://www.tdk.com/pdf/general_B11.pdf; ComponentLink1Description: http://www.tdk.com/pdf/general_B11.pdf; .Checked SCH: used
C340-C342 C345 C346 C349 C350 C368 C370 C371 C374 C380 C435 = C1005X5R1H104K: as C307 on sheet [25] - LEDS, BUTTONS; Category: Capacitors; Supplier Part Number: 445-5942-1-ND; Manufacturer Part Number: C1005X5R1H104K; Operating Temperature: -55°C ~ 85°C; Package / Case: 0402 (1005 Metric); Price 1k [$]: 0.02340; .Checked SCH: used; Voltage - Rated: 50V; Supplier: Digikey; Supplier 1: Digi-Key; Supplier Part Number 1: 445-5942-1-ND; RoHS: RoHS Compliant; Stock 1: 106926; Pricing 1: 1=0.27, 10=0.18, 100=0.072, 250=0.05176, 500=0.0369, 1000=0.027 (USD); Tolerance: ±10%; Temperature Coefficient: X5R; Mounting Type: Surface Mount, MLCC; Applications: General Purpose; Ratings: -; Size / Dimension: 0.039" L x 0.020" W (1.00mm x 0.50mm); Height - Seated (Max): -; Thickness (Max): 0.022" (0.55mm); Lead Spacing: -; Features: -; Packaging: Cut Tape (CT); Lead Style: -; ComponentLink1URL: http://www.tdk.co.jp/tefe02/e412_c.pdf; ComponentLink1Description: http://www.tdk.co.jp/tefe02/e412_c.pdf
C343 = C1005X5R1C474K: CAP CER .47UF 16V X5R 0402; Manufacturer: TDK Corporation; Capacitance: 0.47µF; .Checked PCB: used; Tolerance: ±10%; Category: Capacitors; Supplier Part Number: 445-4976-1-ND; Manufacturer Part Number: C1005X5R1C474K; Operating Temperature: -55°C ~ 85°C; Package / Case: 0402 (1005 Metric); Price 1k [$]: 0.02400; Value: 470nF; .Checked SCH: used; Voltage - Rated: 16V; Supplier: Digikey; Supplier 1: Digi-Key; Supplier Part Number 1: 445-4976-1-ND; RoHS: RoHS Compliant; Stock 1: 141502; Pricing 1: 1=0.24, 10=0.16, 100=0.064, 250=0.046, 500=0.0328, 1000=0.024 (USD); Temperature Coefficient: X5R; Mounting Type: Surface Mount, MLCC; Applications: General Purpose; Ratings: -; Size / Dimension: 0.039" L x 0.020" W (1.00mm x 0.50mm); Height - Seated (Max): -; Thickness (Max): 0.022" (0.55mm); Lead Spacing: -; Features: -; Packaging: Cut Tape (CT); Lead Style: -; ComponentLink1URL: http://www.tdk.co.jp/tefe02/e412_c.pdf; ComponentLink1Description: http://www.tdk.co.jp/tefe02/e412_c.pdf
C352-C363 C424 C425 = GRM188R60G226MEA0L: CAP CER 22UF 4V 20% X5R 0603; Manufacturer: Murata Electronics North America; Capacitance: 22µF; .Checked PCB: used; .Creator: MM; Supplier 1: Digi-Key; Supplier Part Number 1: 490-5526-1-ND; Manufacturer Part Number: GRM188R60G226MEA0L; RoHS: RoHS Compliant; Category: Capacitors; Stock 1: 5760; Pricing 1: 1=0.79, 10=0.663, 50=0.4752, 100=0.4158, 250=0.32672, 500=0.297, 1000=0.2376 (USD); Voltage - Rated: 4V; Tolerance: ±20%; Temperature Coefficient: X5R; Mounting Type: Surface Mount, MLCC; Operating Temperature: -55°C ~ 85°C; Applications: General Purpose; Ratings: -; Package / Case: 0603 (1608 Metric); Size / Dimension: 0.063" L x 0.031" W (1.60mm x 0.80mm); Height - Seated (Max): -; Thickness (Max): 0.035" (0.90mm); Lead Spacing: -; Features: -; Packaging: Cut Tape (CT); Lead Style: -; ComponentLink1URL: http://www.murata.com/products/catalog/pdf/c02e.pdf; ComponentLink1Description: http://www.murata.com/products/catalog/pdf/c02e.pdf; .Checked SCH: used
C364 C365 C426 = C1608X5R0J226M080AC: CAP CER 22UF 6.3V 20% X5R 0603; Manufacturer: TDK Corporation; Capacitance: 22µF; .Creator: MM; Supplier 1: Digi-Key; Manufacturer Part Number: C1608X5R0J226M080AC; RoHS: RoHS Compliant; Category: Capacitors; Stock 1: 593047; Pricing 1: 1=0.39, 10=0.343, 100=0.1714, 250=0.13708, 500=0.12484, 1000=0.1104 (USD); Packaging: Cut Tape (CT); Tolerance: ±20%; Voltage - Rated: 6.3V; Temperature Coefficient: X5R; Mounting Type: Surface Mount, MLCC; Operating Temperature: -55°C ~ 85°C; Applications: General Purpose; Ratings: -; Package / Case: 0603 (1608 Metric); Size / Dimension: 0.063" L x 0.031" W (1.60mm x 0.80mm); Height - Seated (Max): -; Thickness (Max): 0.039" (1.00mm); Lead Spacing: -; Features: -; Lead Style: -; ComponentLink1URL: http://product.tdk.com/en/catalog/datasheets/mlcc_commercial_general_en.pdf; ComponentLink1Description: http://product.tdk.com/en/catalog/datasheets/mlcc_commercial_general_en.pdf; Supplier Part Number 1: 445-8028-1-ND; .Checked PCB: MM; .Checked SCH: MM
C366 C434 = C1608X5R1A226M080AC: CAP CER 22UF 10V X5R 0603; Manufacturer: TDK Corporation; Capacitance: 22µF; Tolerance: ±20%; .Creator: MM; Supplier 1: Digi-Key; Manufacturer Part Number: C1608X5R1A226M080AC; RoHS: RoHS Compliant; Category: Capacitors; Stock 1: 405620; Pricing 1: 1=0.49, 10=0.469, 100=0.2275, 250=0.189, 500=0.1715, 1000=0.1575 (USD); Packaging: Cut Tape (CT); Voltage - Rated: 10V; Temperature Coefficient: X5R; Mounting Type: Surface Mount, MLCC; Operating Temperature: -55°C ~ 85°C; Applications: General Purpose; Ratings: -; Package / Case: 0603 (1608 Metric); Size / Dimension: 0.063" L x 0.031" W (1.60mm x 0.80mm); Height - Seated (Max): -; Thickness (Max): 0.035" (0.90mm); Lead Spacing: -; Features: -; Lead Style: -; ComponentLink1URL: http://product.tdk.com/en/catalog/datasheets/mlcc_commercial_general_en.pdf; ComponentLink1Description: http://product.tdk.com/en/catalog/datasheets/mlcc_commercial_general_en.pdf; Supplier Part Number 1: 445-9077-1-ND; .Checked SCH: MM; .Checked PCB: MM
C367 C376 = C2012X5R1C106M: CAP CER 10UF 16V 20% X5R 0805; Manufacturer: TDK Corporation; Manufacturer Part Number: C2012X5R1C106M/1.25; Capacitance: 10µF; .Checked PCB: used; Supplier 1: Digi-Key; Supplier Part Number 1: 445-4115-1-ND; RoHS: RoHS Compliant; Category: Capacitors; Stock 1: 66161; Pricing 1: 1=0.45, 10=0.357, 100=0.215, 250=0.16124, 500=0.1376, 1000=0.1075 (USD); Voltage - Rated: 16V; Tolerance: ±20%; Temperature Coefficient: X5R; Mounting Type: Surface Mount, MLCC; Operating Temperature: -55°C ~ 85°C; Applications: General Purpose; Ratings: -; Package / Case: 0805 (2012 Metric); Size / Dimension: 0.079" L x 0.049" W (2.00mm x 1.25mm); Height - Seated (Max): -; Thickness (Max): 0.039" (1.00mm); Lead Spacing: -; Features: -; Packaging: Cut Tape (CT); Lead Style: -; ComponentLink1URL: http://www.tdk.com/pdf/general_B11.pdf; ComponentLink1Description: http://www.tdk.com/pdf/general_B11.pdf; .Checked SCH: used
C378 = C1005X5R1E224M: CAP CER .22UF 25V X5R 20% 0402; Manufacturer: TDK Corporation; Capacitance: 0.22µF; Value: 220nF; .Checked PCB: used; Category: Capacitors; Supplier Part Number: 445-5945-1-ND; Manufacturer Part Number: C1005X5R1E224M; Operating Temperature: -55°C ~ 85°C; Package / Case: 0402 (1005 Metric); Price 1k [$]: 0.02600; .Checked SCH: used; Voltage - Rated: 25V; Supplier: Digikey; Supplier 1: Digi-Key; Supplier Part Number 1: 445-5945-1-ND; RoHS: RoHS Compliant; Stock 1: 54593; Pricing 1: 1=0.3, 10=0.2, 100=0.08, 250=0.05752, 500=0.041, 1000=0.03 (USD); Tolerance: ±20%; Temperature Coefficient: X5R; Mounting Type: Surface Mount, MLCC; Applications: General Purpose; Ratings: -; Size / Dimension: 0.039" L x 0.020" W (1.00mm x 0.50mm); Height - Seated (Max): -; Thickness (Max): 0.022" (0.55mm); Lead Spacing: -; Features: -; Packaging: Cut Tape (CT); Lead Style: -; ComponentLink1URL: http://www.tdk.co.jp/tefe02/e412_c.pdf; ComponentLink1Description: http://www.tdk.co.jp/tefe02/e412_c.pdf
C404 = C1005X7R1H103K: CAP CER 10000PF 50V 10% X7R 0402; Manufacturer: TDK Corporation; Value: 10nF; .Checked PCB: used; Capacitance: 10000pF; Category: Capacitors; Supplier Part Number: 445-6850-1-ND; Manufacturer Part Number: C1005X7R1H103K; Operating Temperature: -55°C ~ 125°C; Package / Case: 0402 (1005 Metric); Price 1k [$]: 0.01625; .Checked SCH: used; Voltage - Rated: 50V; Supplier: Digikey; Supplier 1: Digi-Key; Supplier Part Number 1: 445-6850-1-ND; RoHS: RoHS Compliant; Stock 1: 3901; Pricing 1: 1=0.2, 10=0.125, 100=0.045, 250=0.03252, 500=0.024, 1000=0.01625 (USD); Tolerance: ±10%; Temperature Coefficient: X7R; Mounting Type: Surface Mount, MLCC; Applications: General Purpose; Ratings: -; Size / Dimension: 0.039" L x 0.020" W (1.00mm x 0.50mm); Height - Seated (Max): -; Thickness (Max): 0.022" (0.55mm); Lead Spacing: -; Features: -; Packaging: Cut Tape (CT); Lead Style: -; ComponentLink1URL: http://www.tdk.co.jp/tefe02/e412_c.pdf; ComponentLink1Description: http://www.tdk.co.jp/tefe02/e412_c.pdf
D18 = MBR140SFT1G: DIODE SCHOTTKY 40V 1A SOD123L; Manufacturer: ON Semiconductor; Voltage - Forward (Vf) (Max) @ If: 550mV @ 1A; Speed: Fast Recovery =< 500ns, > 200mA (Io); Current - Reverse Leakage @ Vr: 500µA @ 40V; .Creator: MM; Supplier 1: Digi-Key; Manufacturer Part Number: MBR140SFT1G; RoHS: RoHS Compliant; Category: Discrete Semiconductor Products; Stock 1: 9727; Pricing 1: 1=0.47, 10=0.333, 25=0.274, 100=0.2188, 250=0.1594, 500=0.12944, 1000=0.0995 (USD); Packaging: Cut Tape (CT); Diode Type: Schottky; Voltage - DC Reverse (Vr) (Max): 40V; Current - Average Rectified (Io): 1A; Reverse Recovery Time (trr): -; Capacitance @ Vr, F: -; Mounting Type: Surface Mount; Package / Case: SOD-123F; Supplier Device Package: SOD-123L; Operating Temperature - Junction: -55°C ~ 125°C; ComponentLink1URL: http://www.onsemi.com/pub_link/Collateral/MBR140SFT1-D.PDF; ComponentLink1Description: http://www.onsemi.com/pub_link/Collateral/MBR140SFT1-D.PDF; Supplier Part Number 1: MBR140SFT1GOSCT-ND; .Checked PCB: MM; .Checked SCH: MM
FIRMWARE_FOR_U9 = FIRMWARE_OpenRex_PMIC_1.0: .Creator: MM; Category: Firmware; .Checked SCH: MM
L1 L2 = IHLP1212AEER1R0M11: FIXED IND 1UH 3.9A 33 MOHM SMD; Manufacturer: Vishay Dale; Type: Molded; Inductance: 1µH; Tolerance: ±20%; Current - Saturation: 5.3A; Shielding: Shielded; DC Resistance (DCR): 33 mOhm Max; Frequency - Test: 100kHz; .Creator: MM; Supplier 1: Digi-Key; Manufacturer Part Number: IHLP1212AEER1R0M11; RoHS: RoHS Compliant; Category: Inductors, Coils, Chokes; Stock 1: 3480; Pricing 1: 1=1.44, 10=1.35, 100=1.026, 500=0.828, 1000=0.756 (USD); Packaging: Cut Tape (CT); Material - Core: -; Current Rating: 3.9A; Q @ Freq: -; Frequency - Self Resonant: -; Operating Temperature: -55°C ~ 125°C; Mounting Type: Surface Mount; Package / Case: Nonstandard; Size / Dimension: 0.144" L x 0.118" W (3.65mm x 3.00mm); Height - Seated (Max): 0.047" (1.20mm); Supplier Device Package: -; ComponentLink1URL: http://www.vishay.com/docs/34300/lp12ae11.pdf; ComponentLink1Description: http://www.vishay.com/docs/34300/lp12ae11.pdf; Supplier Part Number 1: 541-1327-1-ND; .Checked PCB: MM; .Checked SCH: MM
L8-L10 = IFSC1008ABER1R0M01: FIXED IND 1UH 2.6A 43 MOHM SMD; Manufacturer: Vishay Dale; Inductance: 1µH; Tolerance: ±20%; Current - Saturation: 2.7A; Shielding: Shielded; DC Resistance (DCR): 43 mOhm Max; Frequency - Test: 100kHz; .Creator: MM; Supplier 1: Digi-Key; Manufacturer Part Number: IFSC1008ABER1R0M01; RoHS: RoHS Compliant; Category: Inductors, Coils, Chokes; Stock 1: 46148; Pricing 1: 1=0.62, 10=0.501, 100=0.4175, 500=0.334, 1000=0.3006 (USD); Packaging: Cut Tape (CT); Type: -; Material - Core: -; Current Rating: 2.6A; Q @ Freq: -; Frequency - Self Resonant: -; Operating Temperature: -55°C ~ 125°C; Mounting Type: Surface Mount; Package / Case: Nonstandard; Size / Dimension: 0.098" L x 0.079" W (2.50mm x 2.00mm); Height - Seated (Max): 0.047" (1.20mm); Supplier Device Package: -; ComponentLink1URL: http://www.vishay.com/docs/34294/s108ab01.pdf; ComponentLink1Description: http://www.vishay.com/docs/34294/s108ab01.pdf; Supplier Part Number 1: 541-1388-1-ND; .Checked PCB: MM; .Checked SCH: MM
L11 = IHLP1616ABER2R2M11: FIXED IND 2.2UH 2.75A 83.5 MOHM; Manufacturer: Vishay Dale; Type: Molded; Inductance: 2.2µH; Tolerance: ±20%; Current - Saturation: 3A; Shielding: Shielded; DC Resistance (DCR): 83.5 mOhm Max; Frequency - Self Resonant: 49MHz; Frequency - Test: 100kHz; .Creator: MM; Supplier 1: Digi-Key; Manufacturer Part Number: IHLP1616ABER2R2M11; RoHS: RoHS Compliant; Category: Inductors, Coils, Chokes; Stock 1: 11070; Pricing 1: 1=2.63, 10=2.45, 100=1.82, 500=1.54, 1000=1.435 (USD); Packaging: Cut Tape (CT); Material - Core: -; Current Rating: 2.75A; Q @ Freq: -; Operating Temperature: -55°C ~ 125°C; Mounting Type: Surface Mount; Package / Case: Nonstandard; Size / Dimension: 0.175" L x 0.160" W (4.45mm x 4.06mm); Height - Seated (Max): 0.047" (1.20mm); Supplier Device Package: -; ComponentLink1URL: http://media.digikey.com/pdf/Data%20Sheets/Vishay%20Dale%20PDFs/IHLP-1616-11.pdf; ComponentLink1Description: http://media.digikey.com/pdf/Data%20Sheets/Vishay%20Dale%20PDFs/IHLP-1616-11.pdf; Supplier Part Number 1: 541-1045-1-ND; .Checked PCB: MM; .Checked SCH: MM
R229 R265 = RC0402FR-0710KL: as R140 on sheet [25] - LEDS, BUTTONS; Category: Resistors; Supplier Part Number: 311-10.0KLRCT-ND; Manufacturer Part Number: RC0402FR-0710KL; Package / Case: 0402 (1005 Metric); Price 1k [$]: 0.01421; Resistance (Ohms): 10K; Tolerance: ±1%; Value: 10k; .Checked SCH: used; Supplier: Digikey; Supplier 1: Digi-Key; Supplier Part Number 1: 311-10.0KLRCT-ND; RoHS: RoHS Compliant; Stock 1: 2916495; Pricing 1: 10=0.014, 50=0.0104, 100=0.0079, 250=0.00584, 500=0.00432, 1000=0.00288 (USD); Composition: Thick Film; Features: -; Size / Dimension: 0.039" L x 0.020" W (1.00mm x 0.50mm); Height: 0.016" (0.40mm); Number of Terminations: 2; Packaging: Cut Tape (CT); ComponentLink1URL: http://www.yageo.com/documents/recent/PYu-RC0402_51_RoHS_L_6.pdf; ComponentLink1Description: http://www.yageo.com/documents/recent/PYu-RC0402_51_RoHS_L_6.pdf
R236 R238 R247 R345 R384 = RC0402JR-070RL: as R348 on sheet [25] - LEDS, BUTTONS; Category: Resistors; Supplier Part Number: 311-0.0JRCT-ND; Manufacturer Part Number: RC0402JR-070RL; Package / Case: 0402 (1005 Metric); Price 1k [$]: 0.01389; Value: 0R; .Checked SCH: used; Supplier: Digikey; Supplier 1: Digi-Key; Supplier Part Number 1: 311-0.0JRCT-ND; RoHS: RoHS Compliant; Stock 1: 1106330; Pricing 1: 10=0.012, 50=0.009, 100=0.0069, 250=0.00512, 500=0.0038, 1000=0.00253 (USD); Composition: Thick Film; Features: -; Temperature Coefficient: -; Size / Dimension: 0.039" L x 0.020" W (1.00mm x 0.50mm); Height: 0.016" (0.40mm); Number of Terminations: 2; Packaging: Cut Tape (CT); ComponentLink1URL: http://www.yageo.com/documents/recent/PYu-RC0402_51_RoHS_L_6.pdf; ComponentLink1Description: http://www.yageo.com/documents/recent/PYu-RC0402_51_RoHS_L_6.pdf
R237 R263 R264 = RC0402FR-0747KL: RES 47.0K OHM 1/16W 1% 0402 SMD; Manufacturer: Yageo; Power (Watts): 0.063W, 1/16W; .Checked PCB: used; Temperature Coefficient: ±100ppm/°C; Category: Resistors; Supplier Part Number: 311-47.0KLRCT-ND; Manufacturer Part Number: RC0402FR-0747KL; Package / Case: 0402 (1005 Metric); Price 1k [$]: 0.01421; Resistance (Ohms): 47K; Tolerance: ±1%; Value: 47k; .Checked SCH: used; Supplier: Digikey; Supplier 1: Digi-Key; Supplier Part Number 1: 311-47.0KLRCT-ND; RoHS: RoHS Compliant; Stock 1: 1227580; Pricing 1: 10=0.014, 50=0.0104, 100=0.0079, 250=0.00584, 500=0.00432, 1000=0.00288 (USD); Composition: Thick Film; Features: -; Size / Dimension: 0.039" L x 0.020" W (1.00mm x 0.50mm); Height: 0.016" (0.40mm); Number of Terminations: 2; Packaging: Cut Tape (CT); ComponentLink1URL: http://www.yageo.com/documents/recent/PYu-RC0402_51_RoHS_L_6.pdf; ComponentLink1Description: http://www.yageo.com/documents/recent/PYu-RC0402_51_RoHS_L_6.pdf
R261 R262 R385 = RMCF0402FT100K: as R347 on sheet [25] - LEDS, BUTTONS; Category: Resistors; Supplier Part Number: RMCF0402FT100KCT-ND; Manufacturer Part Number: RMCF0402FT100K; Package / Case: 0402 (1005 Metric); Price 1k [$]: 0.00384; Resistance (Ohms): 100K; Tolerance: ±1%; Value: 100k; .Checked SCH: used; Supplier: Digikey; Supplier 1: Digi-Key; Supplier Part Number 1: RMCF0402FT100KCT-ND; RoHS: RoHS Compliant; Stock 1: 95; Pricing 1: 1=0.04, 10=0.025, 50=0.0138, 100=0.0105, 250=0.0078, 500=0.00576, 1000=0.00384 (USD); Composition: Thick Film; Features: -; Size / Dimension: 0.039" L x 0.020" W (1.00mm x 0.50mm); Height: 0.016" (0.40mm); Number of Terminations: 2; Packaging: Cut Tape (CT); ComponentLink1URL: http://www.seielect.com/Catalog/SEI-RMCF.pdf; ComponentLink1Description: http://www.seielect.com/Catalog/SEI-RMCF.pdf
TP6 TP8 TP11 TP14-TP18 TP21 TP32-TP37 = TP_25MILC: Test Point 25mil
U9 = MMPF0100NPAEP: IC PWR MGMT I.MX6 56QFN; Manufacturer: Freescale Semiconductor; Voltage - Input: 2.8 V ~ 4.5 V; Number of Outputs: 12; Voltage - Output: Multiple; .Creator: MM; Supplier 1: Digi-Key; Manufacturer Part Number: MMPF0100NPAEP; RoHS: RoHS Compliant; Category: Integrated Circuits (ICs); Stock 1: 0; Pricing 1: 260=4.017 (USD); Packaging: Tray; Applications: Converter, i.MX6; Operating Temperature: -40°C ~ 85°C; Mounting Type: Surface Mount; Package / Case: 56-VFQFN Exposed Pad; Supplier Device Package: 56-QFN (8x8); ComponentLink1URL: http://cache.freescale.com/files/analog/doc/data_sheet/MMPF0100.pdf; ComponentLink1Description: http://cache.freescale.com/files/analog/doc/data_sheet/MMPF0100.pdf; Supplier Part Number 1: MMPF0100NPAEP-ND; .Checked PCB: MM; .Checked SCH: MM